# EAGLE design airball_sensor_board_v8_temp (EAGLE 9.6.2)

## Sheet 1 of 2
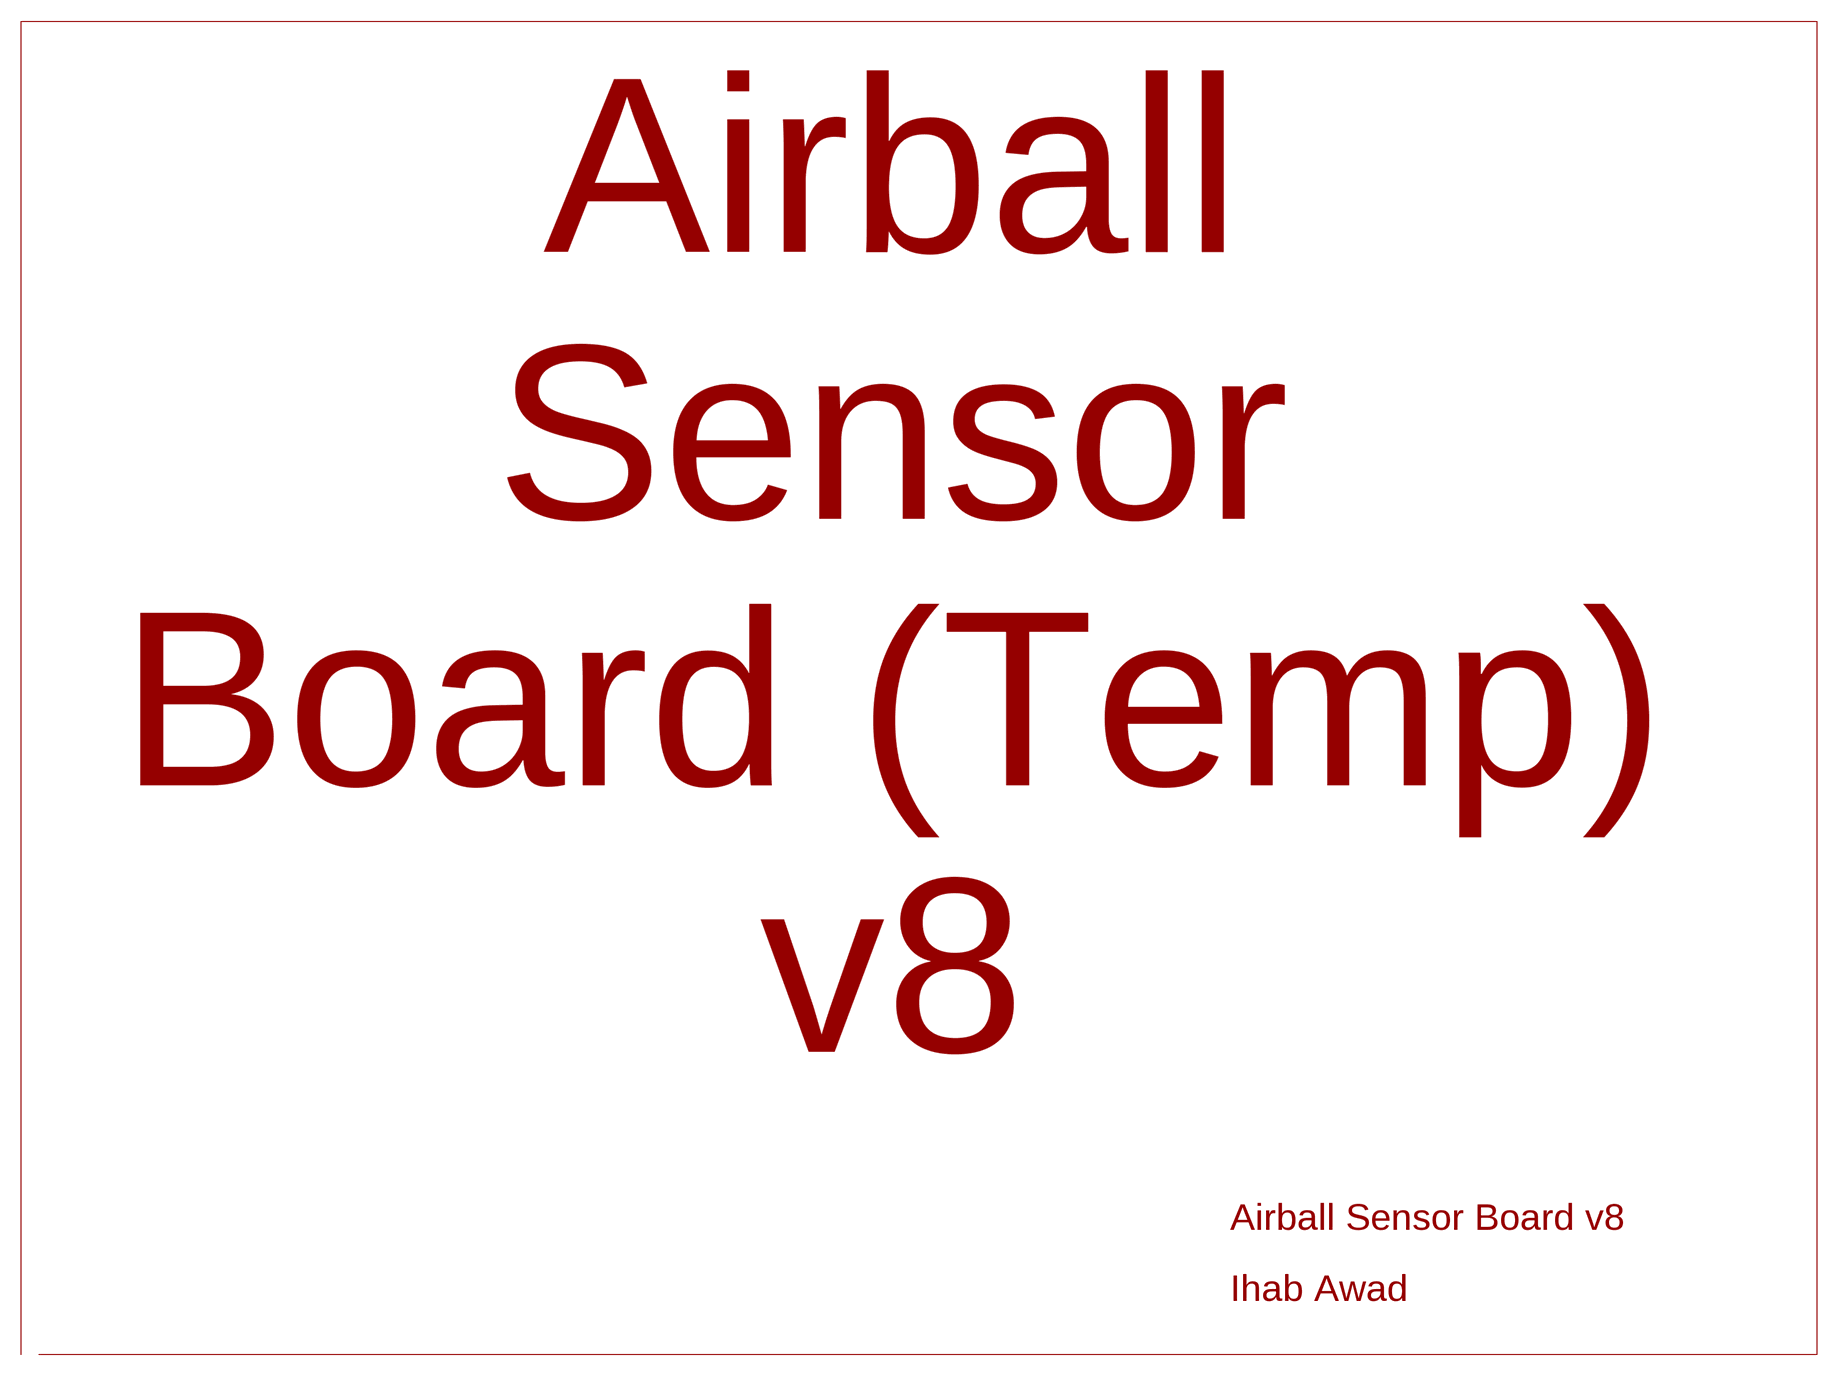
[diagram p0: schematic, sheet 1]

### Notes on the sheet
- Airball
  Sensor
  Board (Temp)
  v8
- Airball Sensor Board v8
- Ihab Awad

## Sheet 2 of 2
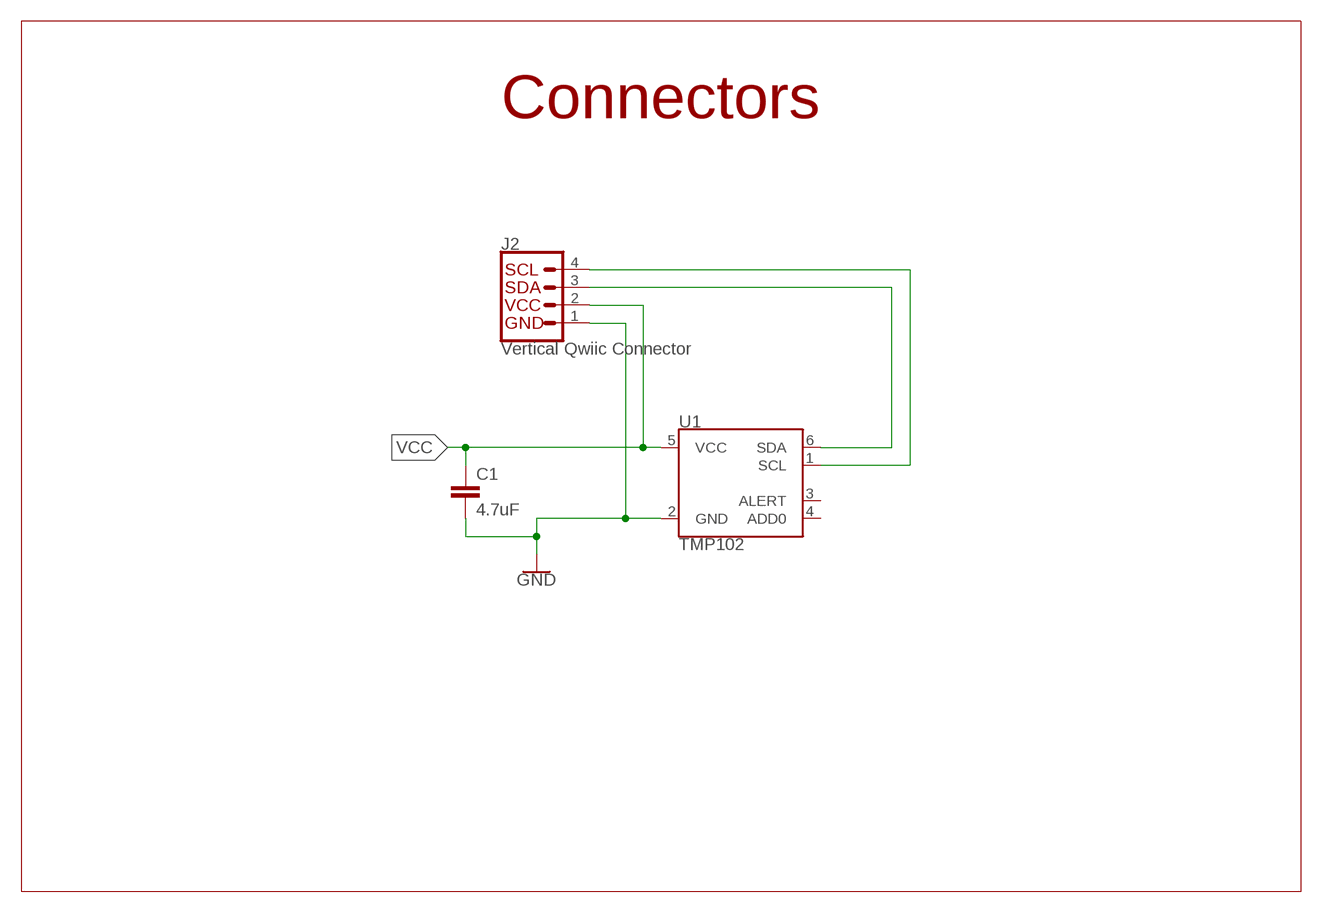
[diagram p1: schematic, sheet 2]

### Parts
C1  4.7uF  4.7UF-0603-6.3V-(10%)  [0603]
J2  Vertical Qwiic Connector  QWIIC_CONNECTOR  [JST04_1MM_VERT]
U1  TMP102  [SOT563]

### Nets
GND: C1.2 J2.1 U1.2(GND)
SCL: J2.4 U1.1(SCL)
SDA: J2.3 U1.6(SDA)
VCC: C1.1 J2.2 U1.5(VCC)
Unconnected: U1.3(ALERT) U1.4(ADD0)

### Notes on the sheet
- Connectors

## Library data of the parts
C1 = SparkFun-Capacitors:4.7UF: 4.7µF ceramic capacitors A capacitor is a passive two-terminal electrical component used to store electrical energy temporarily in an electric field.; PROD_ID: CAP-08280
J2 = SparkFun-Connectors:QWIIC_CONNECTOR: SparkFun I2C Standard Qwiic Connector An SMD 1mm pitch JST connector makes it easy and quick (get it? Qwiic?) to connect I2C devices to each other. The Qwiic system <http://www.sparkfun.com/qwiic> enables fast and solderless connection between popular platforms and various sensors and actuators. We carry 200mm <https://www.sparkfun.com/products/14204>, 100mm <https://www.sparkfun.com/products/14205>, 50mm <https://www.sparkfun.com/products/14206>, and breadboard friendly <https://www.sparkfun.com/products/14207> Qwiic cables. We also offer 10 pcs strips <https://www.sparkfun.com/products/14323> the SMD connectors.; PROD_ID: CONN-14483
U1 = SparkFun-Sensors:TMP102: Texas Instruments TMP102 Low-Power Digital Temperature Sensor The TMP102 is a digital sensor (I2C a.k.a. TWI), has a resolution of 0.0625°C, and is accurate up to 0.5°C. This is a very handy sensor that requires a very low-current. Datasheet <http://www.sparkfun.com/datasheets/Sensors/Temperature/tmp102.pdf> SparkFun Products SparkFun Digital Temperature Sensor Breakout - TMP102 <https://www.sparkfun.com/products/11931> (SEN-11931); PROD_ID: IC-09303

## Net classes
0 default: clearance 0.205 mm

## Board
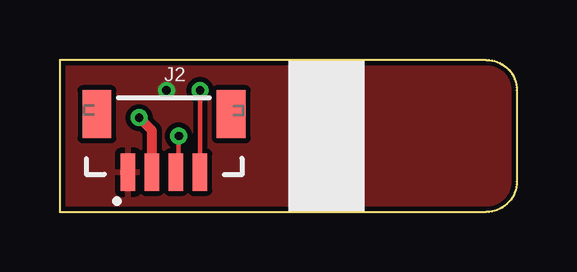
[diagram p2: board, top side]
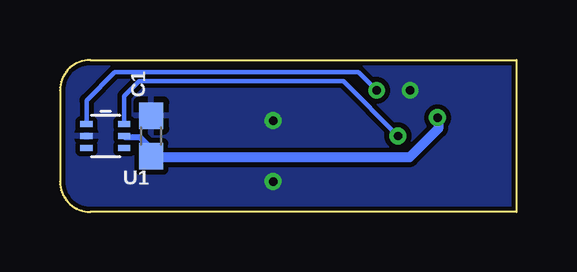
[diagram p3: board, bottom side, seen from below]

Size 19.05 x 6.35 mm. Coordinates in mm from the lower left corner, seen from the top.
Outline: 0,0 17.78,0 arc90 19.05,1.27 19.05,5.08 arc90 17.78,6.35 0,6.35 0,0
Copper layers (1*16): Top 0.035mm / dielectric 1.5mm / Bottom 0.035mm
Design rules "SparkFun-2-Layer-General-JLCPCB": minimum track width 7mil, minimum drill 0.3mm, track to track 7mil, track to pad 7mil, pad to pad 7mil, via to via 7mil, smd to smd 7mil, copper to edge 7mil, drill to drill 7mil, minimum pad ring 7mil, minimum via ring 7mil, stop-mask expansion 3mil, vias tented up to drill 25mil, thermal gap 10mil

### Footprints (pad centres in the part's own frame; a part is rotated, then mirrored left to right if it is on the bottom)
0603 = smd 1.1 x 1: 1 -0.85,0; 2 0.85,0
JST04_1MM_VERT = smd 0.6 x 1.55: 1 -1.478,0.775; 2 -0.478,0.775; 3 0.522,0.775; 4 1.522,0.775 | smd 1.2 x 2: NC1 -2.778,3.2; NC2 2.822,3.2
SOT563 = smd 0.508 x 0.249: 1 -0.8,0.498; 2 -0.8,0.003; 3 -0.8,-0.506; 4 0.776,-0.506; 5 0.776,0.003; 6 0.776,0.498

### Placement (x,y rotation side)
C1  15.24,3.17 90 bottom
J2  4.32,0.89 0 top
U1  17.14,3.17 0 bottom

### Tracks (layer width: path | path; a pad name or v marks a point on that pad's centre or on a via)
GND  (via drill 0.35)
  other vias: 10.16,1.27 10.16,3.81 4.45,5.08
  pour Top: 0,6.35 19.05,6.35 19.05,0 0,0
  pour Bottom: 0,6.35 19.05,6.35 19.05,0 0,0
SCL  (via drill 0.35)
  Top 0.178: J2.4 v5.84,5.08
  Bottom 0.178: v5.84,5.08 6.6,5.84 16.76,5.84 17.95,4.66 U1.1
SDA  (via drill 0.35)
  Top 0.178: v4.95,3.17 4.95,1.78 J2.3
  Bottom 0.178: v4.95,3.17 7.24,5.46 15.75,5.46 16.37,4.84 U1.6
VCC  (via drill 0.35)
  Top 0.406: J2.2 3.84,3.4 v3.3,3.94
  Bottom 0.203: 15.53,2.03 C1.1
  Bottom 0.254: U1.5 16.32,3.13 15.72,3.13 15.24,2.64 C1.1
  Bottom 0.406: v3.3,3.94 3.28,3.91 3.28,3.48 4.48,2.29 15.2,2.29 C1.1